# EAGLE design fanController (EAGLE 7.6.0)
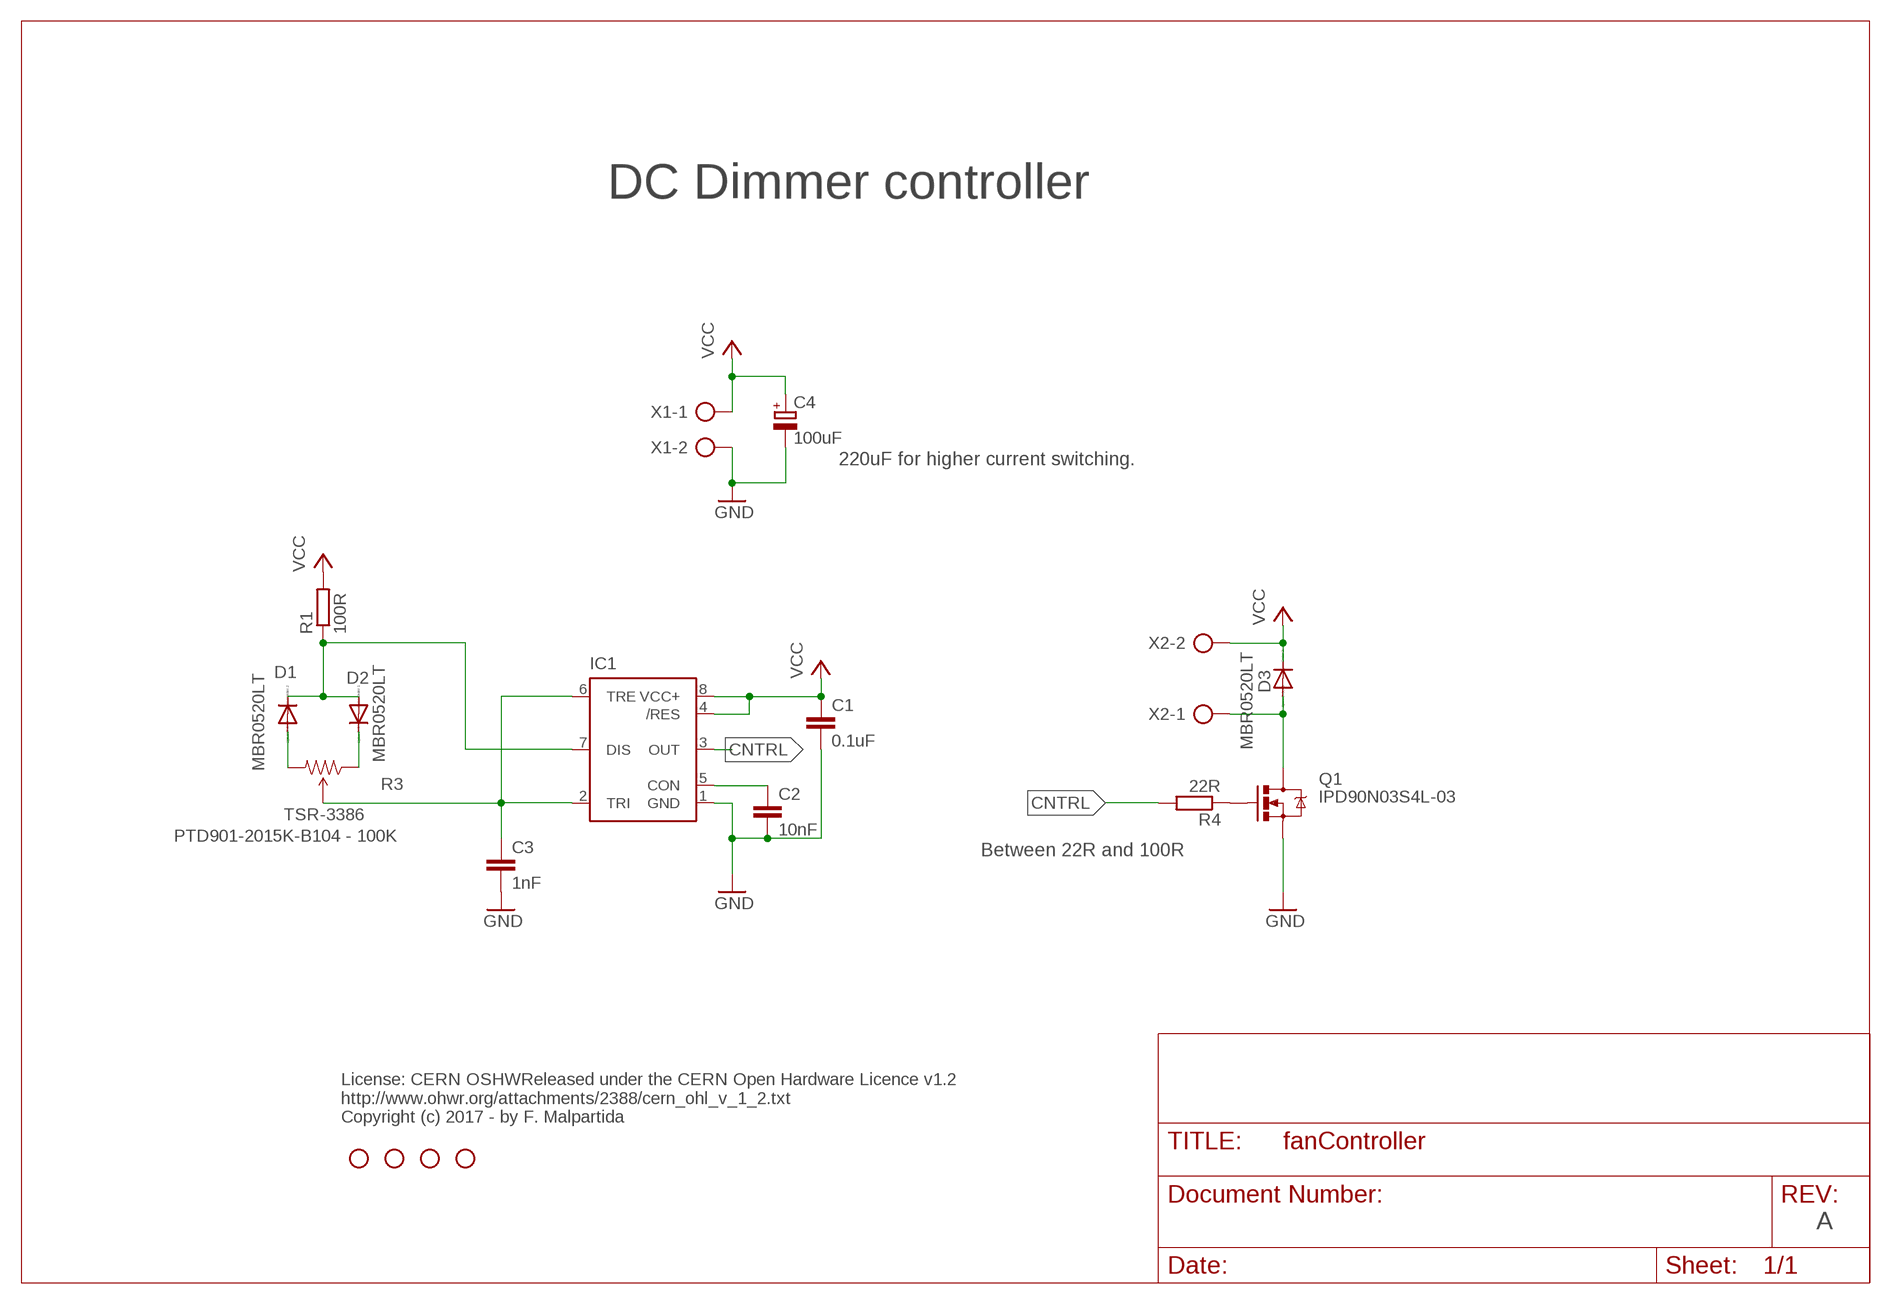
[diagram p0: schematic, sheet 1]

## Parts
C1  0.1uF  C-EUC0805  [C0805]
C2  10nF  C-EUC0805  [C0805]
C3  1nF  C-EUC0805  [C0805]
C4  100uF  CPOL-EUD  [PANASONIC_D]
D1  MBR0520LT  [SOD123]
D2  MBR0520LT  [SOD123]
D3  MBR0520LT  [SOD123]
IC1  NE555D  [SO08]
Q1  IPD90N03S4L-03  MOSFET-NCHANNELFDD8780  [DPAK]
R1  100R  R-EU_M0805  [M0805]
R3  TSR-3386  TRIMPOT-PTH-KNOB  [3386U]
R4  22R  R-EU_M0805  [M0805]
STANDOFF1  STAND-OFFTIGHT  [STAND-OFF-TIGHT]
STANDOFF2  STAND-OFFTIGHT  [STAND-OFF-TIGHT]
STANDOFF3  STAND-OFFTIGHT  [STAND-OFF-TIGHT]
STANDOFF4  STAND-OFFTIGHT  [STAND-OFF-TIGHT]
X1  AK500/2  [AK500/2]
X2  AK500/2  [AK500/2]

## Nets
CNTRL: IC1.3(OUT) R4.2
GND: C1.2 C2.2 C3.2 C4.- IC1.1(GND) Q1.3(S) X1.2
N$1: C2.1 IC1.5(CON)
N$2: D1.A R3.3(CW)
N$3: Q1.1(G) R4.1
N$4: C3.1 IC1.2(TRI) IC1.6(TRE) R3.2(WIPER)
N$5: D1.C D2.A IC1.7(DIS) R1.1
N$6: D2.C R3.1(CCW)
N$8 [VCC]: D3.A Q1.4(D) X2.1
VCC [VCC]: C1.1 C4.+ D3.C IC1.4(/RES) IC1.8(VCC+) R1.2 X1.1 X2.2

## Notes on the sheet
- DC Dimmer controller
- 220uF for higher current switching.
- PTD901-2015K-B104 - 100K
- Between 22R and 100R
- License: CERN OSHWReleased under the CERN Open Hardware Licence v1.2 
  http://www.ohwr.org/attachments/2388/cern_ohl_v_1_2.txt
  Copyright (c) 2017 - by F. Malpartida
- A

## Library data of the parts
C1-C3 = resistor:C-EU: CAPACITOR, European symbol
C4 = rcl:CPOL-EU: POLARIZED CAPACITOR, European symbol
D1-D3 = diode:MBR0520LT: SCHOTTKY BARRIER RECTIFIER Source: http://onsemi.com .. MBR0520LT1-D.pdf
IC1 = SparkFun-AnalogIC:NE555: General purpose bipolar Timer
Q1 = SparkFun-DiscreteSemi:MOSFET-NCHANNEL: Common NMOSFET Parts MFG P/N Store ID Prod ID FDD8780 TRANS-09984 SI7820DN TRANS-11055 FDS6630A IC-08089 2N7002PW TRANS-11151 FQP30N06L COM-10213 TRANS-10060 BSS123LT1G TRANS-08345 BSS138 TRANS-00830 BS170 2N7000; PROD_ID: TRANS-09984
R1 R4 = resistor:R-EU_: RESISTOR, European symbol
R3 = SparkFun-Electromechanical:TRIMPOT: Various small potentiometers for "set-and-forget" applications; PROD_ID: RES-09730
STANDOFF1-STANDOFF4 = SparkFun-Electromechanical:STAND-OFF: #4 Stand Off This is the mechanical footprint for a #4 phillips button head screw. Use the keepout ring to avoid running the screw head into surrounding components. SKU : PRT-00447
X1 X2 = con-ptr500:AK500/2: CONNECTOR; OC_FARNELL: unknown; OC_NEWARK: unknown

## Net classes
1 VCC: clearance 0.305 mm

## Board
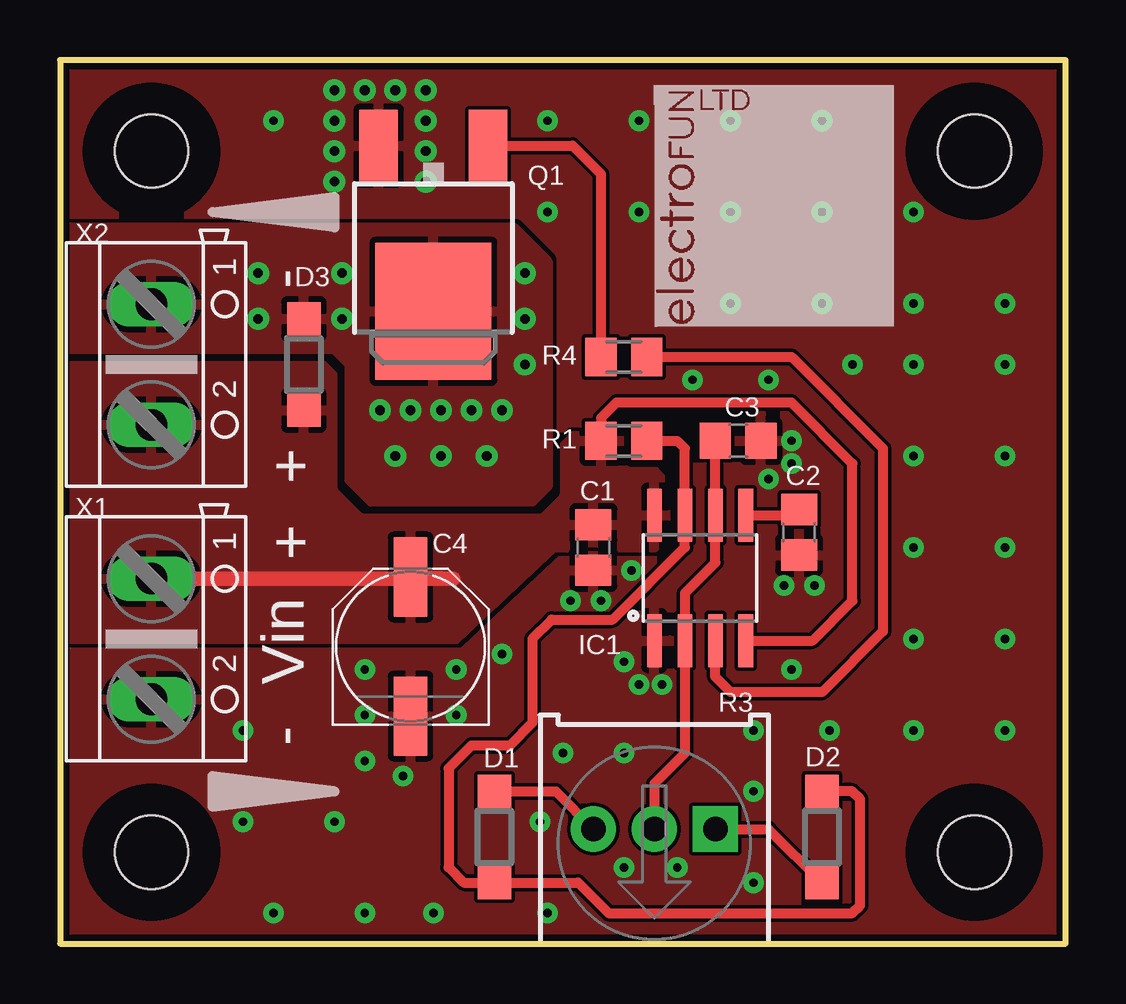
[diagram p1: board, top side]
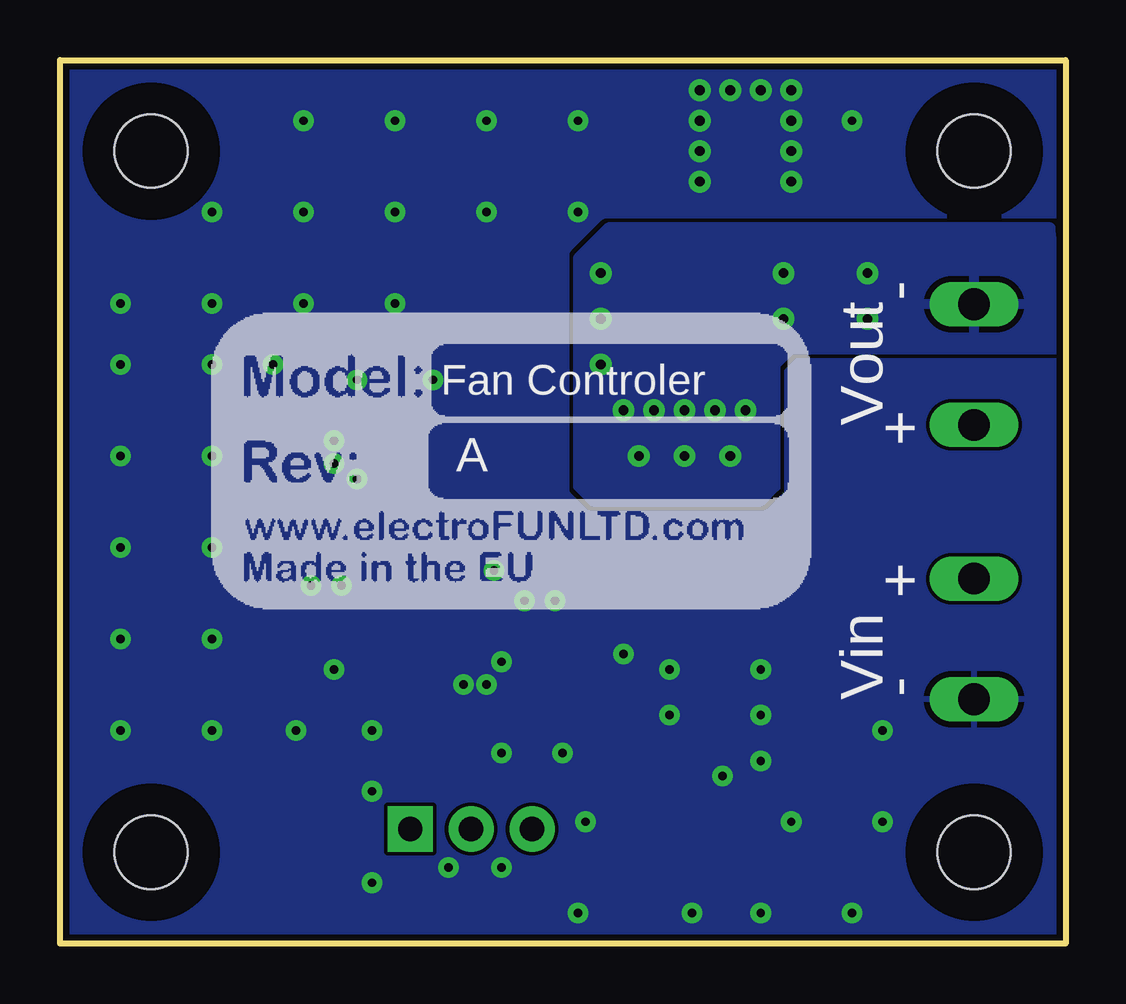
[diagram p2: board, bottom side, seen from below]

Size 41.9 x 36.82 mm. Coordinates in mm from the lower left corner, seen from the top.
Outline: 0,0 41.9,0 41.9,36.82 0,36.82 0,0
Copper layers (1*16): Top 0.035mm / dielectric 1.5mm / Bottom 0.035mm
Design rules "myDesignRules_tight": minimum track width 6mil, minimum drill 0.3mm, track to track 6mil, track to pad 6mil, pad to pad 6mil, via to via 6mil, smd to smd 6mil, copper to edge 10mil, drill to drill 8mil, minimum pad ring 10mil, minimum via ring 10mil, stop-mask expansion 4mil, vias tented up to drill 25mil, thermal gap 10mil

### Footprints (pad centres in the part's own frame; a part is rotated, then mirrored left to right if it is on the bottom)
C0805 = smd 1.3 x 1.5: 1 -0.95,0; 2 0.95,0
PANASONIC_D = smd 3.3 x 1.4: + 2.9,0; - -2.9,0
SOD123 = smd 1.4 x 1.4: A 1.9,0; C -1.9,0
SO08 = smd 0.61 x 2.21: 1 -1.905,-2.616; 2 -0.635,-2.616; 3 0.635,-2.616; 4 1.905,-2.616; 5 1.905,2.616; 6 0.635,2.616; 7 -0.635,2.616; 8 -1.905,2.616
DPAK = smd 1.6 x 3: 1 -2.28,-5.31; 3 2.28,-5.31 | smd 4.826 x 5.715: 4 0,1.588
M0805 = smd 1.3 x 1.6: 1 -0.95,0; 2 0.95,0
3386U = drill 1.016 pad 1.88 square: 1 -2.54,-0.015 | drill 1.016 pad 1.88: 2 0,-0.015; 3 2.54,-0.015
STAND-OFF-TIGHT = hole 3.048: 0,0
AK500/2 = drill 1.321 long: 1 -2.515,0; 2 2.515,0

### Placement (x,y rotation side)
C1  22.23,16.51 270 top
C2  30.8,17.14 270 top
C3  28.26,20.95 0 top
C4  14.61,12.38 90 top
D1  18.1,4.45 90 top
D2  31.75,4.45 90 top
D3  10.16,24.13 90 top
IC1  26.67,15.24 0 top
Q1  15.56,27.94 180 top
R1  23.5,20.95 180 top
R3  24.77,4.76 180 top
R4  23.5,24.45 0 top
STANDOFF1  3.81,3.81 0 top
STANDOFF2  3.81,33.02 0 top
STANDOFF3  38.1,3.81 0 top
STANDOFF4  38.1,33.02 0 top
U$1  [BOARD_REF]  35.56,13.97 0 bottom
U$2  [ELECTROFUN_10X10]  24.77,25.72 0 top
X1  3.81,12.7 270 top
X2  3.81,24.13 270 top

### Tracks (layer width: path | path; a pad name or v marks a point on that pad's centre or on a via)
CNTRL
  Top 0.406: R4.2 30.48,24.45 34.29,20.64 34.29,13.02 31.75,10.48 27.94,10.48 27.3,11.11 IC1.3
GND  (via drill 0.35, 0.4)
  other vias: 31.43,14.92 29.53,19.37 30.48,20.95 30.48,20 21.27,14.29 23.81,15.56 25.08,10.79 11.43,35.56 11.43,34.29 11.43,33.02 12.7,35.56 13.97,35.56 15.24,35.56 15.24,34.29 15.24,33.02 15.24,31.75 11.43,31.75 12.7,7.62 12.7,9.53 14.29,6.99 16.51,9.53 16.51,11.43 12.7,11.43 24.13,34.29 27.94,34.29 31.75,34.29 35.56,30.48 31.75,30.48 27.94,30.48 24.13,30.48 8.89,34.29 39.37,26.67 35.56,26.67 31.75,26.67 27.94,26.67 33.02,24.13 35.56,24.13 39.37,24.13 39.37,20.32 39.37,16.51 39.37,12.7 39.37,8.89 28.89,8.89 20,5.08 11.43,5.08 7.62,5.08 8.89,1.27 12.7,1.27 15.56,1.27 20.32,1.27 20.32,34.29 18.41,12.06 24.13,10.79 35.56,20.32 35.56,16.51 35.56,12.7 35.56,8.89 7.62,8.89 30.16,14.92 30.48,11.43 26.35,23.5 29.53,23.5 22.54,14.29 20.32,30.48 23.5,11.75 23.5,7.94 20.95,7.94 28.89,6.35 32.07,8.89 28.89,2.54 25.72,3.17 23.5,3.17
  pour Top (rank 3): 0,36.83 43.18,36.83 43.18,0 0,0
  pour Bottom (rank 2): 0,36.83 43.18,36.83 43.18,0 0,0
N$1
  Top 0.406: IC1.5 31.11,17.86 C2.1
N$2
  Top 0.406: D1.A 20.66,6.34 R3.3
N$3
  Top 0.406: R4.1 22.55,32.06 21.36,33.25 Q1.1
N$4
  Top 0.406: C3.1 27.3,20.74 IC1.6 27.3,15.88 26.04,14.61 IC1.2 26.04,7.94 24.77,6.67 R3.2
N$5
  Top 0.406: R1.1 25.72,20.95 26.04,20.64 IC1.7 26.04,16.51 23.03,13.5 20.49,13.5 19.68,12.7 19.68,9.21 18.73,8.26 17.14,8.26 16.19,7.3 16.19,3.17 16.83,2.54 D1.C 21.59,2.54 22.86,1.27 33.02,1.27 33.34,1.59 33.34,6.03 33.02,6.35 D2.A
N$6
  Top 0.406: R3.1 29.52,4.78 D2.C
N$8  (via drill 0.4)
  other vias: 8.26,27.94 11.75,27.94 13.34,22.23 14.61,22.23 15.88,22.23 17.14,22.23 18.41,22.23 19.37,26.04 17.78,20.32 15.88,20.32 13.97,20.32 11.75,26.04 19.37,27.94 19.37,24.13 8.26,26.04
  pour Top: 0,29.84 18.9,29.84 20.32,28.43 20.32,19.05 19.68,18.41 12.96,18.41 12.06,19.31 12.06,24.13 11.43,24.77 0,24.77
  pour Bottom: 0.64,29.84 19.05,29.84 20.32,28.57 20.32,19.05 19.68,18.41 12.7,18.41 12.06,19.05 12.06,24.13 11.43,24.77 0,24.77
VCC
  Top 0.406: IC1.4 31.36,12.62 33.02,14.29 33.02,20 30.48,22.54 23.18,22.54 22.54,21.91 R1.2
  Top 0.61: X1.1 16.39,15.21 C4.+
  pour Top (rank 2): 0,24.13 0,12.7 16.51,12.7 20.58,16.51 24.77,16.51 25.4,17.14 25.4,19.05 24.77,19.68 24.13,19.68 23.5,20.32 23.5,21.59 21.85,21.59 20.95,20.69 20.95,19.05 19.68,17.78 12.7,17.78 11.43,19.05 11.43,24.13

### Text on the board
tPlace: - | + | + | Vin | -
bPlace: - | Fan Controler | Vout | + | A | + | - | Vin